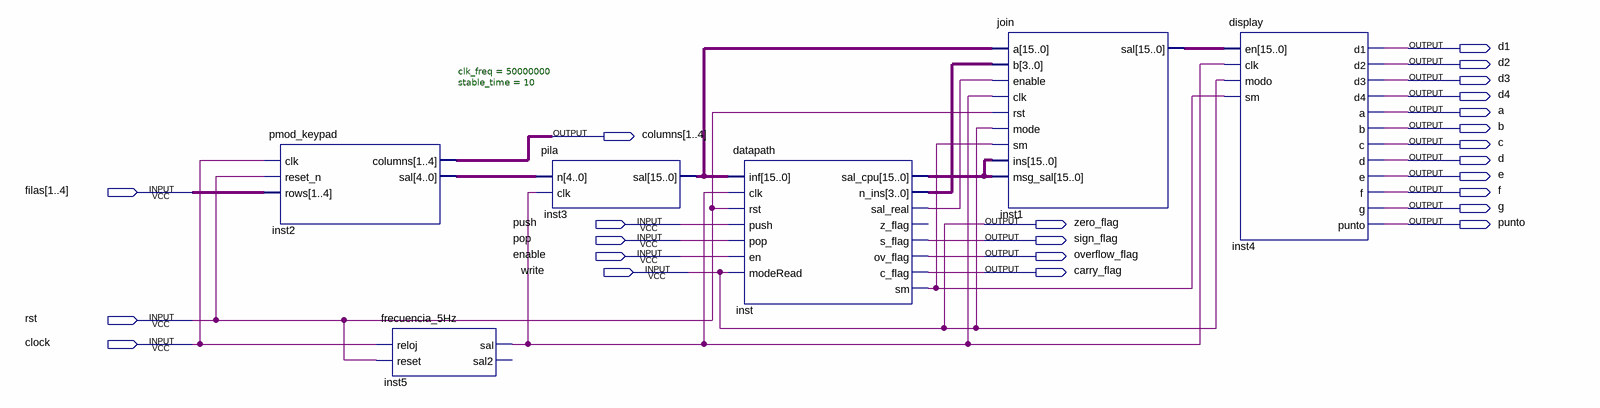
[diagram p0: schematic sheet]
// Quartus schematic pilaFinal.bdf as structural Verilog: 6 symbols, 24 pins
module pilaFinal (
  input  [1:4] filas,
  input  push,
  input  pop,
  input  enable,
  input  write,
  input  rst,
  input  clock,
  output d1,
  output d2,
  output d3,
  output d4,
  output a,
  output b,
  output [1:4] columns,
  output c,
  output d,
  output e,
  output f,
  output g,
  output zero_flag,
  output punto,
  output sign_flag,
  output overflow_flag,
  output carry_flag
);

  wire inst5_sal, inst_sal_real, inst_sm;
  wire [3:0] inst_n_ins;
  wire [4:0] inst2_sal;
  wire [15:0] inst1_sal, inst3_sal, inst_sal_cpu;

  pmod_keypad #(.clk_freq(50000000), .stable_time(10)) inst2 (
    .clk(clock), .reset_n(rst), .rows(filas), .columns(columns), .sal(inst2_sal));
  frecuencia_5Hz inst5 (.reloj(clock), .reset(rst), .sal(inst5_sal));  // open: sal2
  pila inst3 (.n(inst2_sal), .clk(inst5_sal), .sal(inst3_sal));
  datapath inst (
    .inf(inst3_sal), .clk(inst5_sal), .rst(rst), .push(push), .pop(pop), .en(enable), .modeRead(write),
    .sal_cpu(inst_sal_cpu), .n_ins(inst_n_ins), .sal_real(inst_sal_real), .s_flag(sign_flag),
    .ov_flag(overflow_flag), .c_flag(carry_flag), .sm(inst_sm));  // open: z_flag
  \join  inst1 (
    .a(inst3_sal), .b(inst_n_ins), .enable(inst_sal_real), .clk(inst5_sal), .rst(rst), .mode(write),
    .sm(inst_sm), .ins(inst_sal_cpu), .msg_sal(inst_sal_cpu), .sal(inst1_sal));
  display inst4 (
    .en(inst1_sal), .clk(inst5_sal), .modo(write), .sm(inst_sm), .d1(d1), .d2(d2), .d3(d3), .d4(d4), .a(a),
    .b(b), .c(c), .d(d), .e(e), .f(f), .g(g), .punto(punto));

  assign zero_flag = write;
endmodule
